# Altium schematic sheet Sheet_2.schdoc
size 156 x 196 mm
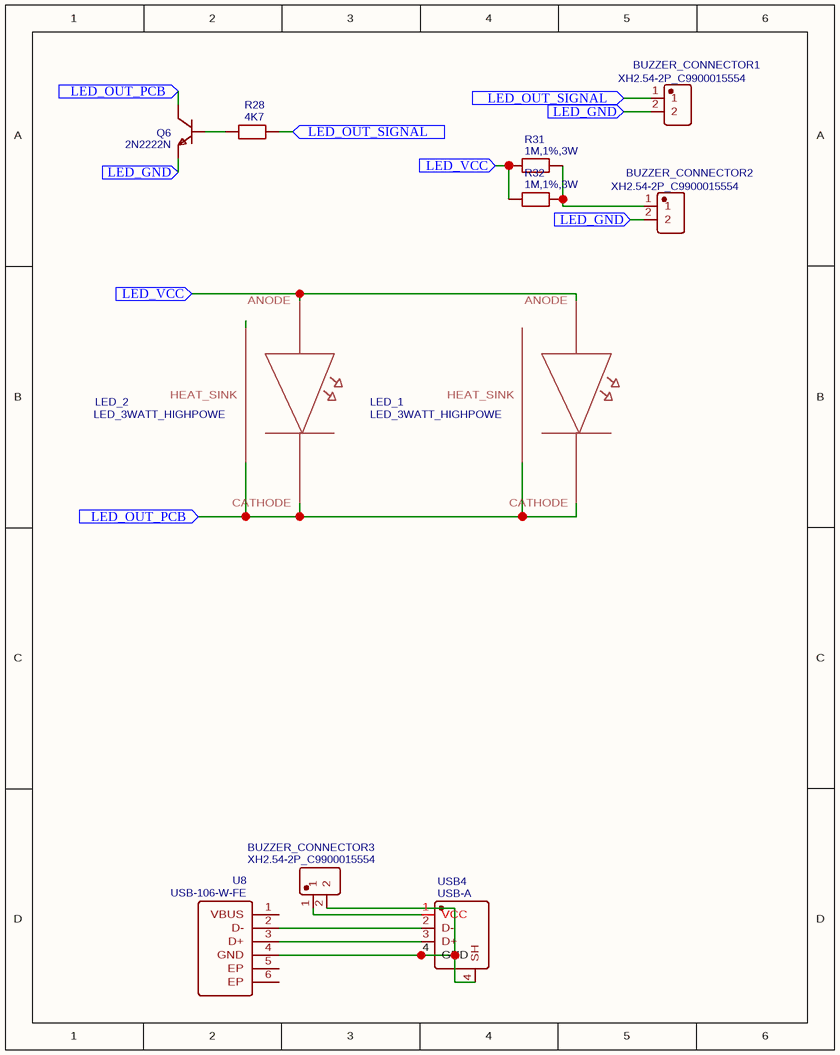
[diagram p0: Sheet_2.schdoc]

## Parts
BUZZER_CONNECTOR1  XH2.54-2P_C9900015554  [CONN-TH_XH2.54-2P]
BUZZER_CONNECTOR2  XH2.54-2P_C9900015554  [CONN-TH_XH2.54-2P]
BUZZER_CONNECTOR3  XH2.54-2P_C9900015554  [CONN-TH_XH2.54-2P]
LED_1  LED_3WATT_HIGHPOWE  [3WLED]
LED_2  LED_3WATT_HIGHPOWE  [3WLED]
Q6  2N2222N  [2N2222N]
R28  4K7  [1/4 WATT RESISTOR]
R31  1M,1%,3W  [RES_3WATT]
R32  1M,1%,3W  [RES_3WATT]
U8  USB-106-W-FE  [USB-A-TH_USB-106]
USB4  USB-A  [USB-A-TH_SIDE-SINK-USB-A]

## Ports
LED_GND (in), LED_OUT_PCB (in), LED_OUT_SIGNAL (in), LED_VCC (in)

## Nets
LED_GND: BUZZER_CONNECTOR1.2 BUZZER_CONNECTOR2.2 Q6.1(E) ; port LED_GND
LED_OUT_PCB: LED_1.P$2(CATHODE) LED_2.P$2(CATHODE) Q6.3(C) ; port LED_OUT_PCB
LED_OUT_SIGNAL: BUZZER_CONNECTOR1.1 R28.2 ; port LED_OUT_SIGNAL
LED_VCC: LED_1.P$1(ANODE) LED_2.P$1(ANODE) R31.1 R32.1 ; port LED_VCC
NetBUZZER_CONNECTOR2_1: BUZZER_CONNECTOR2.1 R31.2 R32.2
NetBUZZER_CONNECTOR3_1: BUZZER_CONNECTOR3.1 USB4.1(VCC)
NetBUZZER_CONNECTOR3_2: BUZZER_CONNECTOR3.2 U8.4(GND) USB4.4(SH)
NetQ6_2: Q6.2(B) R28.1
NetU8_2: U8.2(D-) USB4.2(D-)
NetU8_3: U8.3(D+) USB4.3(D+)

Not connected (* = marked no-connect by the designer): LED_1 P$3(HEAT_SINK); LED_2 P$3(HEAT_SINK); U8 1(VBUS) 5(EP) 6(EP)

## Library data of the parts
BUZZER_CONNECTOR1-BUZZER_CONNECTOR3 = XH2.54-2P_C9900015554: Manufacturer: null; Contributor: lcsc; Supplier: LCSC; Supplier Part: C9900015554; Manufacturer Part: XH2.54-2P; JLCPCB Part Class: Extended Part; spicePre: C; spiceSymbolName: XH2.54-2P_C9900015554
LED_1 LED_2 = LED_3WATT_HIGHPOWE: Contributor: vikalpvs; spicePre: ?; spiceSymbolName: LED_3WATT_HIGHPOWE
Q6 = 2N2222N: Manufacturer: BLUE ROCKET(蓝箭); Manufacturer Part: 2N2222A; Contributor: Lee Smith; Supplier: LCSC; Supplier Part: C358533; JLCPCB Part Class: Extended Part; spicePre: Q; spiceSymbolName: 2N2222N
R28 = 4K7: Contributor: canarywood; spicePre: R; spiceSymbolName: 1.0K
R31 R32 = 1M,1%,3W: Manufacturer: Ohmite; Manufacturer Part: MOX1125231005G; Contributor: NavinL; Supplier: LCSC; Supplier Part: C3391929; link: https://atta.szlcsc.comnull; spicePre: R; spiceSymbolName: MOX1125231005G
U8 = USB-106-W-FE: Manufacturer: HOOYA(皓宇电子); Contributor: lcsc; Supplier: LCSC; Supplier Part: C2939557; Manufacturer Part: USB-106-W-FE; spicePre: U; spiceSymbolName: USB-106-W-FE
USB4 = USB-A: Manufacturer: null; Contributor: LCSC; Package Display: No; Supplier: LCSC; Supplier Part: C9900005029; Manufacturer Part: USB-A; spicePre: U; spiceSymbolName: USB-A